# Altium schematic sheet Server_CPU_Power_Supplies_2.SchDoc
size D
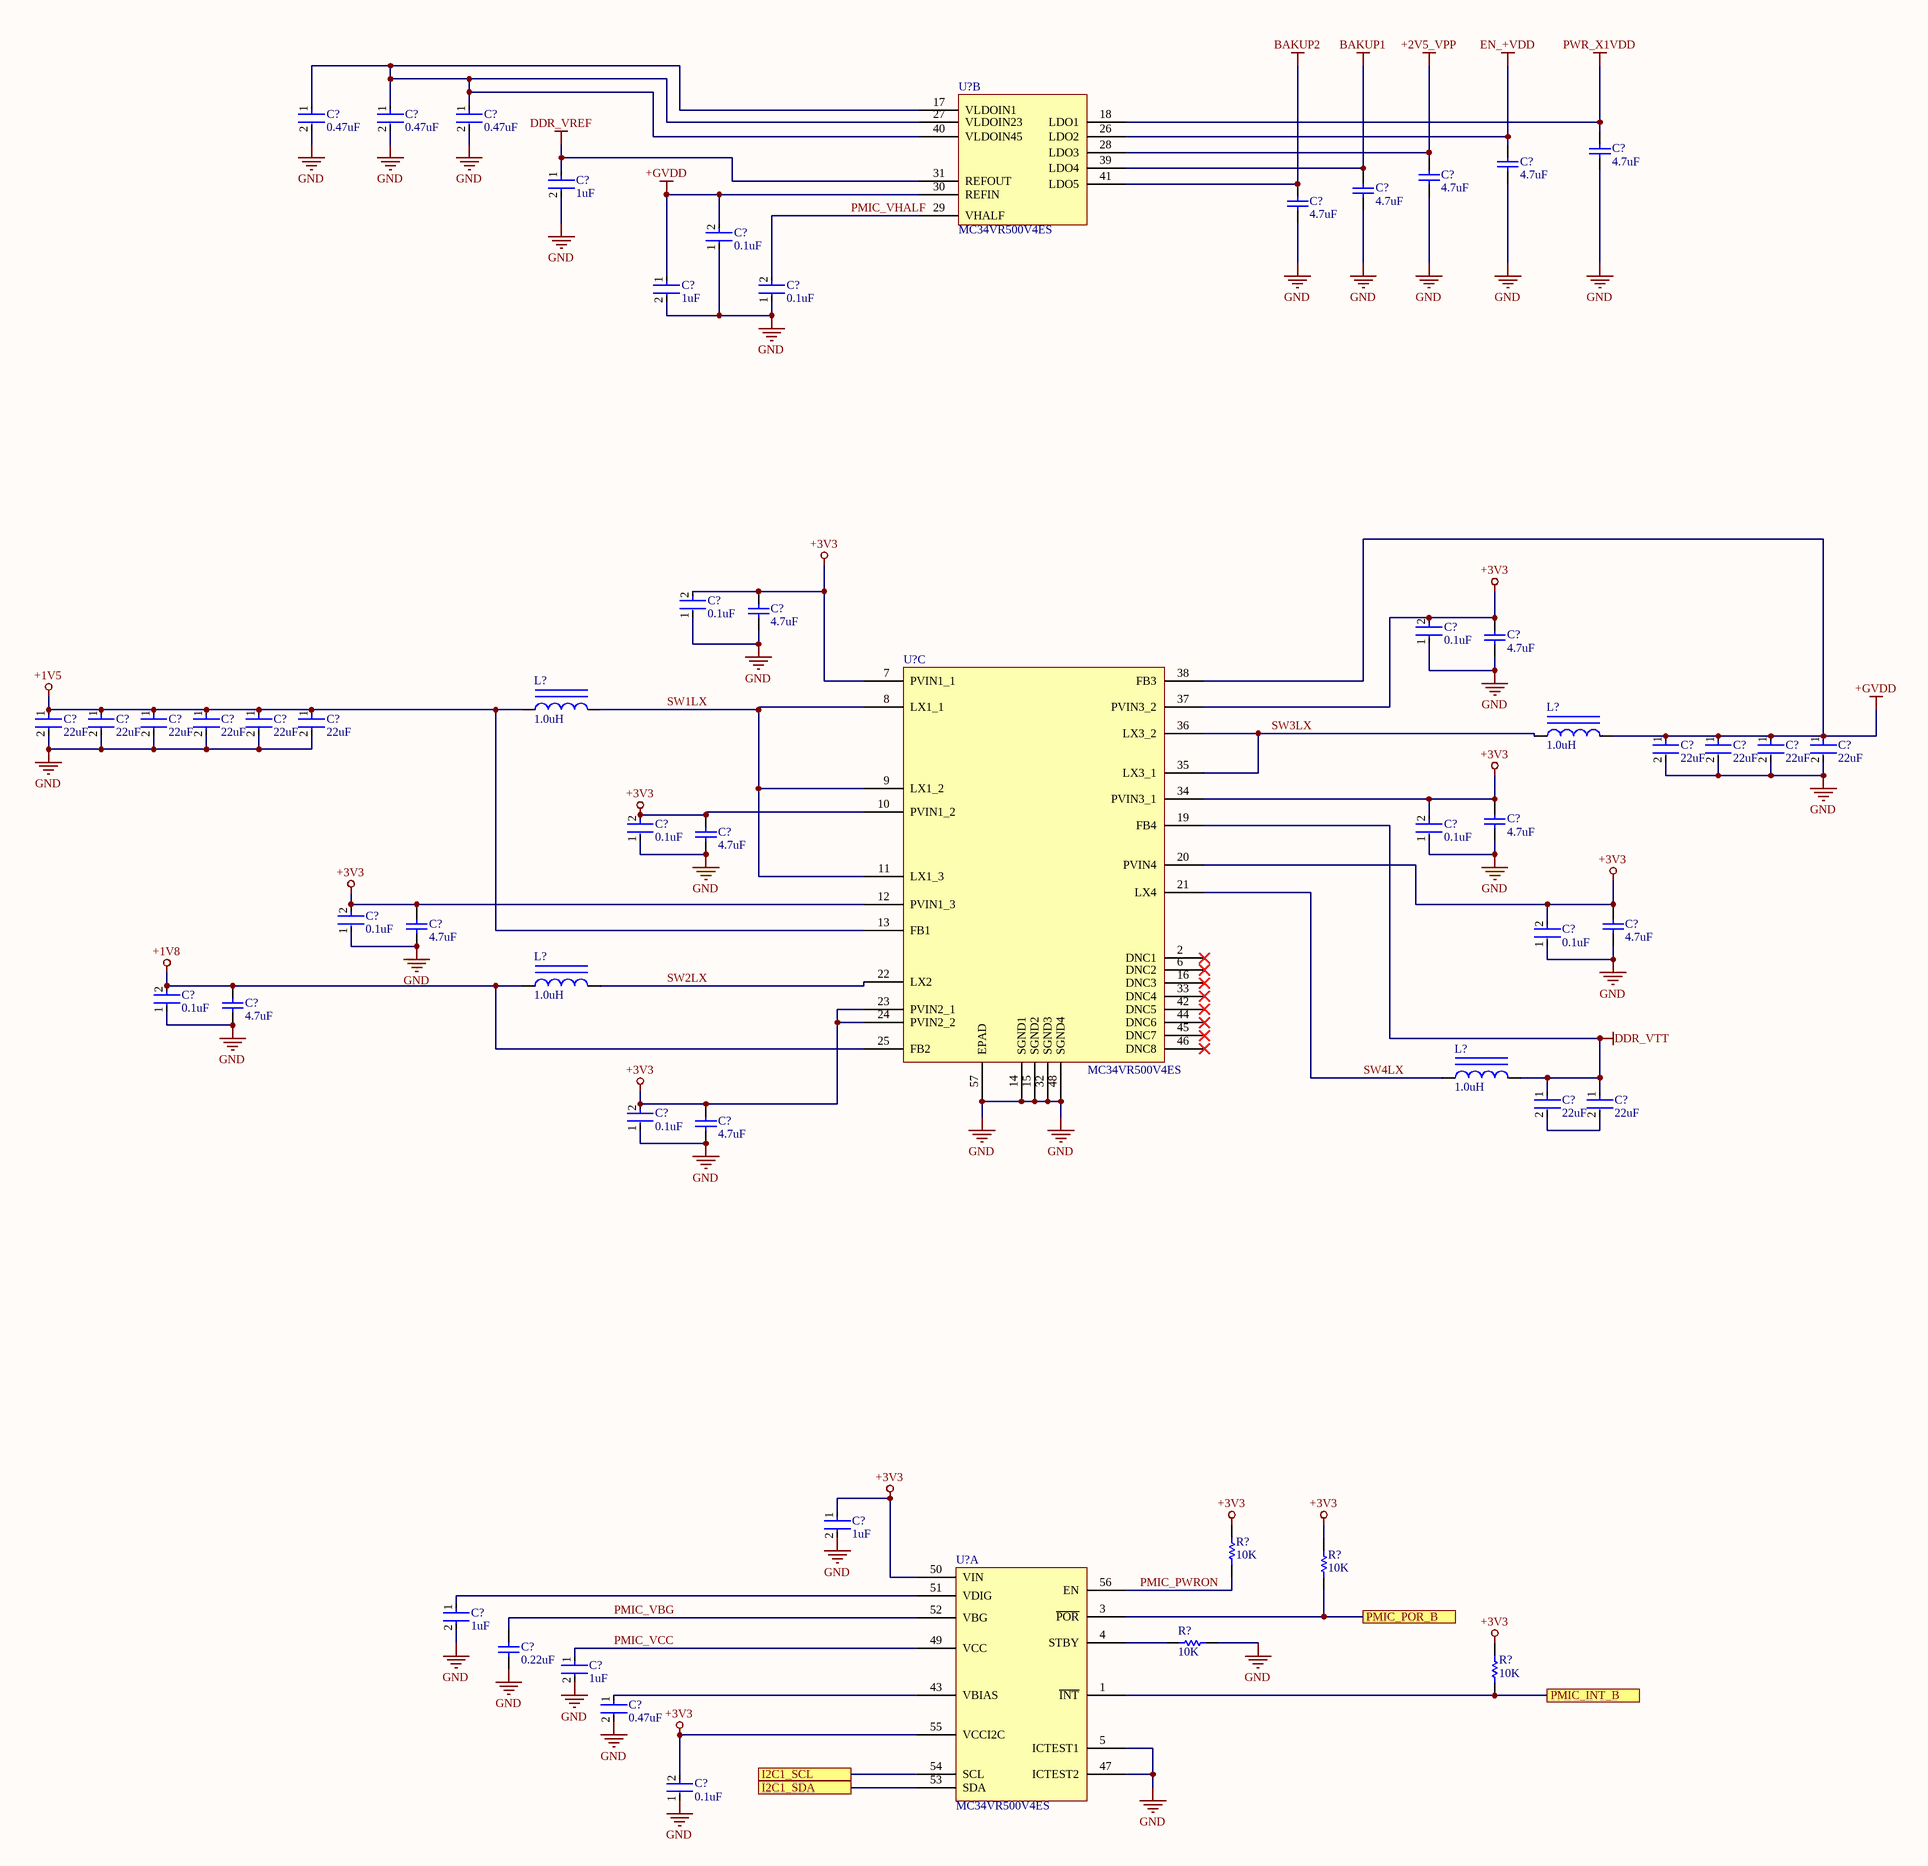
[diagram p0: Server_CPU_Power_Supplies_2.SchDoc]

## Parts
(Parts that share a designator on the sheet are numbered #1, #2 ... from top to bottom, then left to right.)
C?#1  0.47uF  [FP-GRM188-0_1-e0_2_0_5-IPC_B]
C?#2  0.47uF  [FP-GRM188-0_1-e0_2_0_5-IPC_B]
C?#3  0.47uF  [FP-GRM188-0_1-e0_2_0_5-IPC_B]
C?#4  4.7uF  [CAPC2013X145X50ML20T25]
C?#5  1uF  [FP-GRM15-0_1-MFG]
C?#6  4.7uF  [CAPC2013X145X50ML20T25]
C?#7  4.7uF  [CAPC2013X145X50ML20T25]
C?#8  4.7uF  [CAPC2013X145X50ML20T25]
C?#9  4.7uF  [CAPC2013X145X50ML20T25]
C?#10  0.1uF  [FP-GRM15-MFG]
C?#11  1uF  [FP-GRM15-0_1-MFG]
C?#12  0.1uF  [FP-GRM15-MFG]
C?#13  0.1uF  [FP-GRM15-MFG]
C?#14  4.7uF  [CAPC2013X145X50ML20T25]
C?#15  0.1uF  [FP-GRM15-MFG]
C?#16  4.7uF  [CAPC2013X145X50ML20T25]
C?#17  22uF  [FP-GRM21B-0_15-MFG]
C?#18  22uF  [FP-GRM21B-0_15-MFG]
C?#19  22uF  [FP-GRM21B-0_15-MFG]
C?#20  22uF  [FP-GRM21B-0_15-MFG]
C?#21  22uF  [FP-GRM21B-0_15-MFG]
C?#22  22uF  [FP-GRM21B-0_15-MFG]
C?#23  22uF  [FP-GRM21B-0_15-MFG]
C?#24  22uF  [FP-GRM21B-0_15-MFG]
C?#25  22uF  [FP-GRM21B-0_15-MFG]
C?#26  22uF  [FP-GRM21B-0_15-MFG]
C?#27  0.1uF  [FP-GRM15-MFG]
C?#28  0.1uF  [FP-GRM15-MFG]
C?#29  4.7uF  [CAPC2013X145X50ML20T25]
C?#30  4.7uF  [CAPC2013X145X50ML20T25]
C?#31  0.1uF  [FP-GRM15-MFG]
C?#32  0.1uF  [FP-GRM15-MFG]
C?#33  4.7uF  [CAPC2013X145X50ML20T25]
C?#34  4.7uF  [CAPC2013X145X50ML20T25]
C?#35  0.1uF  [FP-GRM15-MFG]
C?#36  4.7uF  [CAPC2013X145X50ML20T25]
C?#37  22uF  [FP-GRM21B-0_15-MFG]
C?#38  22uF  [FP-GRM21B-0_15-MFG]
C?#39  0.1uF  [FP-GRM15-MFG]
C?#40  4.7uF  [CAPC2013X145X50ML20T25]
C?#41  1uF  [FP-GRM15-0_1-MFG]
C?#42  1uF  [FP-GRM15-0_1-MFG]
C?#43  1uF  [FP-GRM15-0_1-MFG]
C?#44  0.22uF  [CAPC1005X55X25NL05T10]
C?#45  0.47uF  [FP-GRM188-0_1-e0_2_0_5-IPC_B]
C?#46  0.1uF  [FP-GRM15-MFG]
L?#1  1.0uH  [BOUR-CM45_L]
L?#2  1.0uH  [BOUR-CM45_L]
L?#3  1.0uH  [BOUR-CM45_L]
L?#4  1.0uH  [BOUR-CM45_L]
R?#1  10K  [RESC1005X40X25LL05T05]
R?#2  10K  [RESC1005X40X25LL05T05]
R?#3  10K  [RESC1005X40X25LL05T05]
R?#4  10K  [RESC1005X40X25LL05T05]
U?#1  MC34VR500V4ES  [QFN50P800X800X90-57N]  (part B of 3)
U?#2  MC34VR500V4ES  [QFN50P800X800X90-57N]  (part C of 3)
U?#3  MC34VR500V4ES  [QFN50P800X800X90-57N]  (part A of 3)

## Ports
I2C1_SCL, I2C1_SDA, PMIC_INT_B, PMIC_POR_B

## Nets
+1V5: C?#17.1 C?#18.1 C?#19.1 C?#20.1 C?#21.1 C?#22.1 L?#1.1 U?#2.13(FB1)
+1V8: C?#35.2 C?#36.2 L?#3.1 U?#2.25(FB2)
+2V5_VPP: C?#7.2 U?#1.28(LDO3)
+3V3: C?#13.2 C?#14.2 C?#15.2 C?#16.2 C?#27.2 C?#28.2 C?#29.2 C?#30.2 C?#31.2 C?#32.2 C?#33.2 C?#34.2 C?#39.2 C?#40.2 C?#41.1 C?#46.2 R?#1.2 R?#2.2 R?#4.2 U?#2.7(PVIN1_1) U?#2.10(PVIN1_2) U?#2.12(PVIN1_3) U?#2.20(PVIN4) U?#2.23(PVIN2_1) U?#2.24(PVIN2_2) U?#2.34(PVIN3_1) U?#2.37(PVIN3_2) U?#3.50(VIN) U?#3.55(VCCI2C)
+GVDD: C?#10.2 C?#11.1 C?#23.1 C?#24.1 C?#25.1 C?#26.1 L?#2.2 U?#1.30(REFIN) U?#2.38(FB3)
BAKUP1: C?#8.2 U?#1.39(LDO4)
BAKUP2: C?#9.2 U?#1.41(LDO5)
DDR_VREF: C?#5.1 U?#1.31(REFOUT)
DDR_VTT: C?#37.1 C?#38.1 L?#4.2 U?#2.19(FB4)
EN_+VDD: C?#6.2 U?#1.26(LDO2)
GND: C?#1.2 C?#2.2 C?#3.2 C?#4.1 C?#5.2 C?#6.1 C?#7.1 C?#8.1 C?#9.1 C?#10.1 C?#11.2 C?#12.1 C?#13.1 C?#14.1 C?#15.1 C?#16.1 C?#17.2 C?#18.2 C?#19.2 C?#20.2 C?#21.2 C?#22.2 C?#23.2 C?#24.2 C?#25.2 C?#26.2 C?#27.1 C?#28.1 C?#29.1 C?#30.1 C?#31.1 C?#32.1 C?#33.1 C?#34.1 C?#35.1 C?#36.1 C?#39.1 C?#40.1 C?#41.2 C?#42.2 C?#43.2 C?#44.1 C?#45.2 C?#46.1 R?#3.1 U?#2.14(SGND1) U?#2.15(SGND2) U?#2.32(SGND3) U?#2.48(SGND4) U?#2.57(EPAD) U?#3.5(ICTEST1) U?#3.47(ICTEST2)
PWR_X1VDD: C?#4.2 U?#1.18(LDO1)
I2C1_SCL: U?#3.54(SCL) ; port I2C1_SCL
I2C1_SDA: U?#3.53(SDA) ; port I2C1_SDA
PMIC_INT_B: R?#4.1 U?#3.1(~{INT}) ; port PMIC_INT_B
PMIC_POR_B: R?#2.1 U?#3.3(~{POR}) ; port PMIC_POR_B
PMIC_PWRON: R?#1.1 U?#3.56(EN)
PMIC_VBG: C?#44.2 U?#3.52(VBG)
PMIC_VCC: C?#43.1 U?#3.49(VCC)
PMIC_VHALF: C?#12.2 U?#1.29(VHALF)
SW1LX: L?#1.2 U?#2.8(LX1_1) U?#2.9(LX1_2) U?#2.11(LX1_3)
SW2LX: L?#3.2 U?#2.22(LX2)
SW3LX: L?#2.1 U?#2.35(LX3_1) U?#2.36(LX3_2)
SW4LX: L?#4.1 U?#2.21(LX4)
NetC?#1_1: C?#1.1 C?#2.1 C?#3.1 U?#1.17(VLDOIN1) U?#1.27(VLDOIN23) U?#1.40(VLDOIN45)
NetC?#37_2: C?#37.2 C?#38.2
NetC?#42_1: C?#42.1 U?#3.51(VDIG)
NetC?#45_1: C?#45.1 U?#3.43(VBIAS)
NetR?#3_2: R?#3.2 U?#3.4(STBY)

Not connected (* = marked no-connect by the designer): U?#2 2(DNC1)* 6(DNC2)* 16(DNC3)* 33(DNC4)* 42(DNC5)* 44(DNC6)* 45(DNC7)* 46(DNC8)*

## Notes on the sheet
- Title
- Size:
- Date:
- File:
- D
- Number:
- Time:
- Revision:
- Sheet
- of

## Library data of the parts
C?#1-C?#3 C?#45 = CMP-2006-02860-2: Chip Multilayer Ceramic Capacitors for General Purpose, 0603, 0.47uF, X7R, 15%, 10%, 16V; Capacitance: 470nF; Material: Ceramic; Termination: SMD/SMT; Case Code (Imperial): 0603; Height: 0.8mm; Dielectric: X7R; Length: 1.6mm; Packaging: Tape and Reel; Mount: Surface Mount; Thickness: 0.035inch; Voltage Rating (DC): 16V; Case Code (Metric): 1608; REACH SVHC: No SVHC; Depth: 0.8mm; Number of Pins: 2; Max Operating Temperature: 125°C; Min Operating Temperature: -55°C; Width: 0.8mm; Voltage: 16V; Lead Free: Lead Free; Voltage Rating: 16V; Package Quantity: 1; Case/Package: 0603; Tolerance: 10%
C?#4 C?#6-C?#9 C?#14 C?#16 C?#29 C?#30 C?#33 C?#34 C?#36 C?#40 = CMP-2007-01010-1: Manufacturer: Kemet; Part Number: C0805C475K3PACTU
C?#5 C?#11 C?#41-C?#43 = CMP-2008-04556-2: CAP CER 1UF 10V X5R 0402; Manufacturer Part Number: GRM155R61A105KE15D; Manufacturer: Murata; Material: Ceramic; Tolerance: 10%; Temperature Coefficient: 15%; Octopart: https://octopart.com/grm155r61a105ke15d-murata-197442; Lead Free: Yes; ComponentLink2Description: Datasheet; Temperature: -55°C to +85°C; Temperature Range High: +85°C; Height: 0.55mm; Capacitance: 1uF; Ipc Land Pattern Name: CAPC10050X50; ComponentLink2URL: https://search.murata.co.jp/Ceramy/image/img/A01X/G101/ENG/GRM155R61A105KE15-01A.pdf; Temperature Range Low: -55°C; Device Class L2: Capacitors; Voltage Rating: 10V; RoHS: TRUE; Device Class L1: Passive Components; Device Class L3: Ceramic Capacitors; Temperature Characteristic: X5R; Mouser Description: 0402 1 uF 10 V ±10% Tolerance X5R Surface Mount Multilayer Ceramic Capacitor; Automotive: No; Package: GRM15-0.1; Digikey Description: CAP CER 1UF 10V X5R 0402; Value: 1uF; Category: Cap
C?#10 C?#12 C?#13 C?#15 C?#27 C?#28 C?#31 C?#32 C?#35 C?#39 C?#46 = CMP-2100-03641-2: CAP CER 0.1UF 16V X7R 0402; Manufacturer Part Number: GRM155R71C104KA88D; Manufacturer: Murata; Standoff Height: 0mm; Tolerance: 10%; Voltage Rating: 16Vdc; Material: Ceramic; Capacitance: 0.10μF; Value: 0.10μF; RoHS: TRUE; Temperature Characteristic: X7R; Octopart: https://octopart.com/grm155r71c104ka88d-murata-196880; Digikey Description: CAP CER 0.1UF 16V X7R 0402; Device Class L3: Ceramic Capacitors; Height: 0.55mm; ComponentLink2Description: Datasheet; Temperature Range Low: -55°C; Ipc Land Pattern Name: CAPC10050X219; ComponentLink2URL: https://search.murata.co.jp/Ceramy/image/img/A01X/G101/ENG/GRM155R71H471KA01-01A.pdf; Device Class L1: Passive Components; Lead Free: yes; Category: Cap; Package: GRM15; Temperature: -55°C to +125°C; Device Class L2: Capacitors; Temperature Range High: +125°C; Mouser Description: 0402 0.1 uF 16V ±10 % Tolerance X7R SMT Multilayer Ceramic Capacitor
C?#17-C?#26 C?#37 C?#38 = CMP-2007-03385-2: Chip Multilayer Ceramic Capacitors for General Purpose, 0805, 22uF, X5R, 15%, 20%, 6.3V; Material: Ceramic; Max Operating Temperature: 85°C; Voltage: 6.3V; Min Operating Temperature: -55°C; Case/Package: 0805; Thickness: 0.053inch; Dielectric: X5R; Packaging: Tape and Reel; Depth: 1.25mm; Termination: SMD/SMT; Voltage Rating (DC): 6.3V; Radiation Hardening: No; Tolerance: 20%; Mount: Surface Mount; Lead Free: Lead Free; Package Quantity: 1; REACH SVHC: No SVHC; Voltage Rating: 6.3V; Capacitance: 22uF; Length: 2mm; Case Code (Imperial): 0805; Case Code (Metric): 2012; Width: 0.049inch; Height: 1.25mm
C?#44 = CMP-2008-04561-4: Chip Capacitor, 220 nF, +/- 10%, 10 V, -55 to 85 degC, 0402 (1005 Metric), RoHS, Tape and Reel; Manufacturer: Basic Passives; PartNumber: GRM155R61A224KE19D; Case\/Package: 0402; Voltage Rating: 10 V; Type (Capacitors): X5R; Capacitance: 220 nF; Max Operating Temperature: 85 degC; Package Quantity: 1; RoHSCompliant: true; Height: 0.5 mm; Mounting Technology: Surface Mount; Case Code (Metric): 1005; ComponentLink2URL: http://search.murata.co.jp/Ceramy/image/img/A01X/G101/ENG/GRM155R61A224KE19-01.pdf; Case Code (Imperial): 0402; Length: 1 mm; Radiation Hardening: No; Tolerance: 10%; Pins: 2; ComponentLink1Description: Manufacturer URL; Voltage Rating (DC): 10 V; Width: 0.5 mm; REACH SVHC: No SVHC; ComponentLink1URL: http://www.murata.com/; Min Operating Temperature: -55 degC; DatasheetVersion: 03/2016; Mount: Surface Mount; PackageReference: 0402; Packaging: Tape and Reel; ComponentLink2Description: Datasheet; PackageDescription: 2-Pin Surface Mount Device, Body 1 x 0.5 mm
L?#1-L?#4 = CMP-2000-06114-1: Chip Inductor, 1 uH, +/- 10%, 450 mA, -40 to 125 degC, 2-Pin SMD (1812), RoHS, Tape and Reel; Manufacturer: Bourns; Nominal inductivity: 1µH; Content: 1pc(s); Nominal current: 0.45A; Type: CM453232-1R0KL; Category: Inductor; Package Description: 2-Pin Surface Mount Device, Body 4.5 x 3.2 mm; Manufacturer URL: http://www.bourns.com/; LN: 1µH; Package Reference: CM45; Mounting Technology: SurfaceMount; Datasheet URL: http://www.bourns.com/docs/Product-Datasheets/cm.pdf; Datasheet Version: 03/2016
R?#1-R?#4 = CMP-2000-07588-1: Chip Resistor, 10 KOhm, +/- 1%, 0.1 W, -55 to 155 degC, 0402 (1005 Metric), RoHS, Tape and Reel; Manufacturer: Panasonic; Power Rating: 100mW; Voltage Rating: 50V; Resistance: 10KOhm; Case\/Package: 0402; Temperature Coefficient: 100ppm\/degreesC; RoHSCompliant: True; Lead Free: LeadFree; Package Quantity: 1; Contact Plating: Tin; Length: 1mm; Radiation Hardening: No; REACH SVHC: NoSVHC; Max Operating Temperature: 155degC; Depth: 0.5mm; Case Code (Imperial): 0402; Military Standard: Not; Package Description: 2-Pin Surface Mount Device, Body 1 x 0.5 mm; Termination: SMD/SMT; Case Code (Metric): 1005; Height: 0.35mm; Packaging: TapeandReel; Voltage Rating (DC): 50V; Package Reference: 402; Number of Pins: 2; Tolerance: 1%; Mounting Technology: SurfaceMount; Width: 0.02inch; Mount: SurfaceMount; Datasheet URL: https://industrial.panasonic.com/cdbs/www-data/pdf/RDA0000/AOA0000C304.pdf; Composition: ThickFilm; Datasheet Version: 02/2017; Manufacturer URL: http://www.panasonic.com/; Max Power Dissipation: 100mW; Number of Terminations: 2; Min Operating Temperature: -55degC
U?#1-U?#3 = MC34VR500V4ES: Regulator, Buck, Quad with up to 4.5A Output and Triple User-programmable LDOs, QFN 56, Tray; MF: {'manufacturer': u'NXP Semiconductors'}; Package: None; MP: MC34VR500V4ES; Value: *; Availability: Unavailable; Price: None